# Altium schematic sheet indication.SchDoc
size A4; SheetNumber: 5; SheetTotal: 6
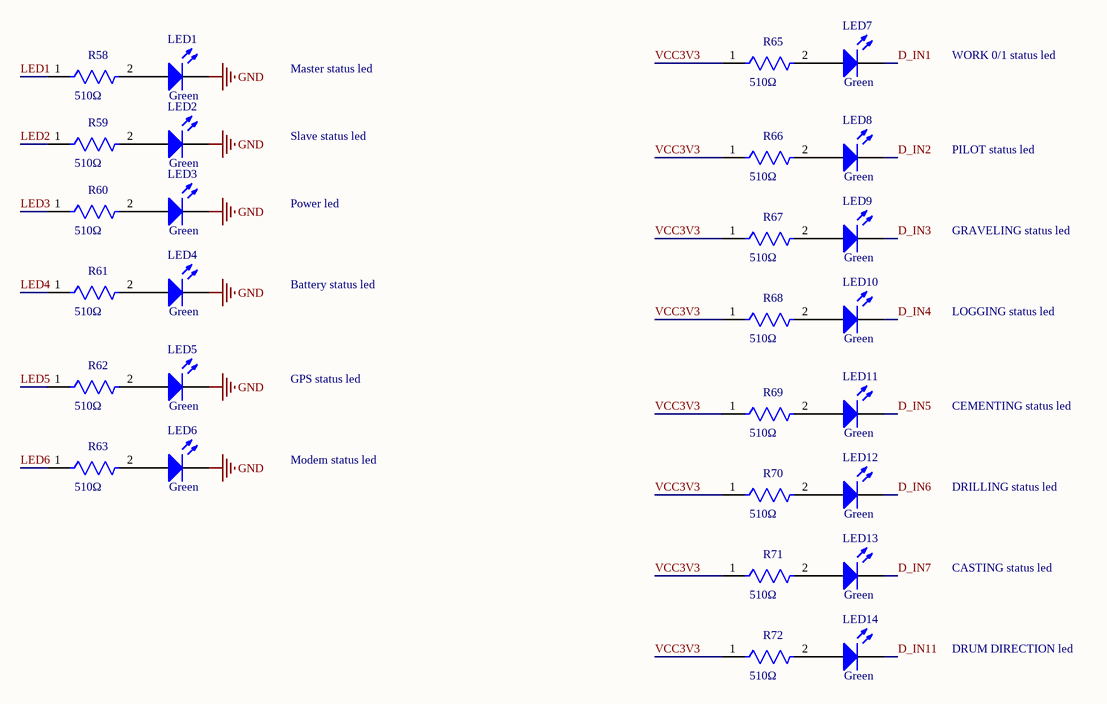
[diagram p0: indication.SchDoc]

## Parts
LED1  Color: Green  [0805_A]  (hidden comment: 150080GS75000)
LED2  Color: Green  [0805_A]  (hidden comment: 150080GS75000)
LED3  Color: Green  [0805_A]  (hidden comment: 150080GS75000)
LED4  Color: Green  [0805_A]  (hidden comment: 150080GS75000)
LED5  Color: Green  [0805_A]  (hidden comment: 150080GS75000)
LED6  Color: Green  [0805_A]  (hidden comment: 150080GS75000)
LED7  Color: Green  [0805_A]  (hidden comment: 150080GS75000)
LED8  Color: Green  [0805_A]  (hidden comment: 150080GS75000)
LED9  Color: Green  [0805_A]  (hidden comment: 150080GS75000)
LED10  Color: Green  [0805_A]  (hidden comment: 150080GS75000)
LED11  Color: Green  [0805_A]  (hidden comment: 150080GS75000)
LED12  Color: Green  [0805_A]  (hidden comment: 150080GS75000)
LED13  Color: Green  [0805_A]  (hidden comment: 150080GS75000)
LED14  Color: Green  [0805_A]  (hidden comment: 150080GS75000)
R58  Resistance: 510Ω  [FP-AC0805-MFG]  (hidden comment: AC0805FR-07510RL)
R59  Resistance: 510Ω  [FP-AC0805-MFG]  (hidden comment: AC0805FR-07510RL)
R60  Resistance: 510Ω  [FP-AC0805-MFG]  (hidden comment: AC0805FR-07510RL)
R61  Resistance: 510Ω  [FP-AC0805-MFG]  (hidden comment: AC0805FR-07510RL)
R62  Resistance: 510Ω  [FP-AC0805-MFG]  (hidden comment: AC0805FR-07510RL)
R63  Resistance: 510Ω  [FP-AC0805-MFG]  (hidden comment: AC0805FR-07510RL)
R65  Resistance: 510Ω  [FP-AC0805-MFG]  (hidden comment: AC0805FR-07510RL)
R66  Resistance: 510Ω  [FP-AC0805-MFG]  (hidden comment: AC0805FR-07510RL)
R67  Resistance: 510Ω  [FP-AC0805-MFG]  (hidden comment: AC0805FR-07510RL)
R68  Resistance: 510Ω  [FP-AC0805-MFG]  (hidden comment: AC0805FR-07510RL)
R69  Resistance: 510Ω  [FP-AC0805-MFG]  (hidden comment: AC0805FR-07510RL)
R70  Resistance: 510Ω  [FP-AC0805-MFG]  (hidden comment: AC0805FR-07510RL)
R71  Resistance: 510Ω  [FP-AC0805-MFG]  (hidden comment: AC0805FR-07510RL)
R72  Resistance: 510Ω  [FP-AC0805-MFG]  (hidden comment: AC0805FR-07510RL)

## Nets
GND: LED1.1(K) LED2.1(K) LED3.1(K) LED4.1(K) LED5.1(K) LED6.1(K)
D_IN1: LED7.1(K)
D_IN2: LED8.1(K)
D_IN3: LED9.1(K)
D_IN4: LED10.1(K)
D_IN5: LED11.1(K)
D_IN6: LED12.1(K)
D_IN7: LED13.1(K)
D_IN11: LED14.1(K)
LED1: R58.1
LED2: R59.1
LED3: R60.1
LED4: R61.1
LED5: R62.1
LED6: R63.1
VCC3V3: R65.1 R66.1 R67.1 R68.1 R69.1 R70.1 R71.1 R72.1
NetLED1_2: LED1.2(A) R58.2
NetLED2_2: LED2.2(A) R59.2
NetLED3_2: LED3.2(A) R60.2
NetLED4_2: LED4.2(A) R61.2
NetLED5_2: LED5.2(A) R62.2
NetLED6_2: LED6.2(A) R63.2
NetLED7_2: LED7.2(A) R65.2
NetLED8_2: LED8.2(A) R66.2
NetLED9_2: LED9.2(A) R67.2
NetLED10_2: LED10.2(A) R68.2
NetLED11_2: LED11.2(A) R69.2
NetLED12_2: LED12.2(A) R70.2
NetLED13_2: LED13.2(A) R71.2
NetLED14_2: LED14.2(A) R72.2

## Notes on the sheet
- Master status led
- WORK 0/1 status led
- Slave status led
- PILOT status led
- Power led
- Battery status led
- GRAVELING status led
- LOGGING status led
- GPS status led
- CEMENTING status led
- Modem status led
- DRILLING status led
- CASTING status led
- DRUM DIRECTION led

## Library data of the parts
LED1-LED14 = CMP-1426-00007-1: SMD mono-color Chip LED, WL-SMCW, Green; Manufacturer: Wuerth Elektronik; PackageReference: 0805_A; PartNumber: 150080GS75000; ComponentLink2URL: http://katalog.we-online.com/led/datasheet/150080GS75000.pdf; ComponentLink1URL: http://www.we-online.com; ComponentLink1Description: Manufacturer URL; ComponentLink2Description: Datasheet
R58-R63 R65-R72 = CMP-03412-037669-1: RES SMD 510 OHM 1% 1/8W 0805; Manufacturer: Yageo; Automotive Grade: Grade 0; Value: 510Ω; Tolerance: 0.01; Voltage Rating: 150V; Device Class L2: Resistors; Series: AC; Footprint Url: http://www.yageo.com/exep/pages/download/literatures/PYu-R_Mount_10.pdf; Height: 0.6mm; Composition: Thick Film; Device Class L1: Passive Components; Power Rating: 1/8W; Category: Res; Package: AC0805; Digikey Description: RES SMD 510 OHM 1% 1/8W 0805; Manufacturer Part Number: AC0805FR-07510RL; Lead Free: Yes; ComponentLink2URL: http://www.yageo.com/documents/recent/PYu-AC_51_RoHS_L_6.pdf; Ipc Land Pattern Name: RESC200125X50; RoHS: TRUE; Device Class L3: Chip SMD Resistors; Automotive: Yes; Temperature: -55°C to +155°C; Temperature Range High: +155°C; ComponentLink2Description: Datasheet; Octopart: https://octopart.com/ac0805fr-07510rl-yageo-71367760; Mouser Description: Thick Film Resistors - SMD 1/8W 510ohm 1% AEC-Q200; Temperature Range Low: -55°C